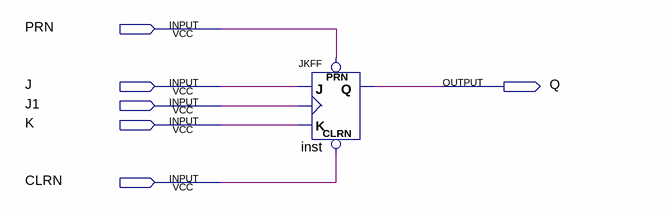
[diagram p0: schematic sheet]
// Quartus schematic JK-flipflopDiagram.bdf as structural Verilog: 1 symbols, 6 pins
module \JK-flipflopDiagram  (
  input  PRN,
  input  J,
  input  J1,
  input  K,
  input  CLRN,
  output Q
);

  JKFF inst (.PRN(PRN), .CLRN(CLRN), .K(K), .J(J), .CLK(J1), .Q(Q));
endmodule
